# EAGLE design flotsamRowControllerv11a (EAGLE 6.5.0)
CNAME: Pattern Matrix Row Controller; CREVISION: 1.1; DESIGNER: Andy Smith
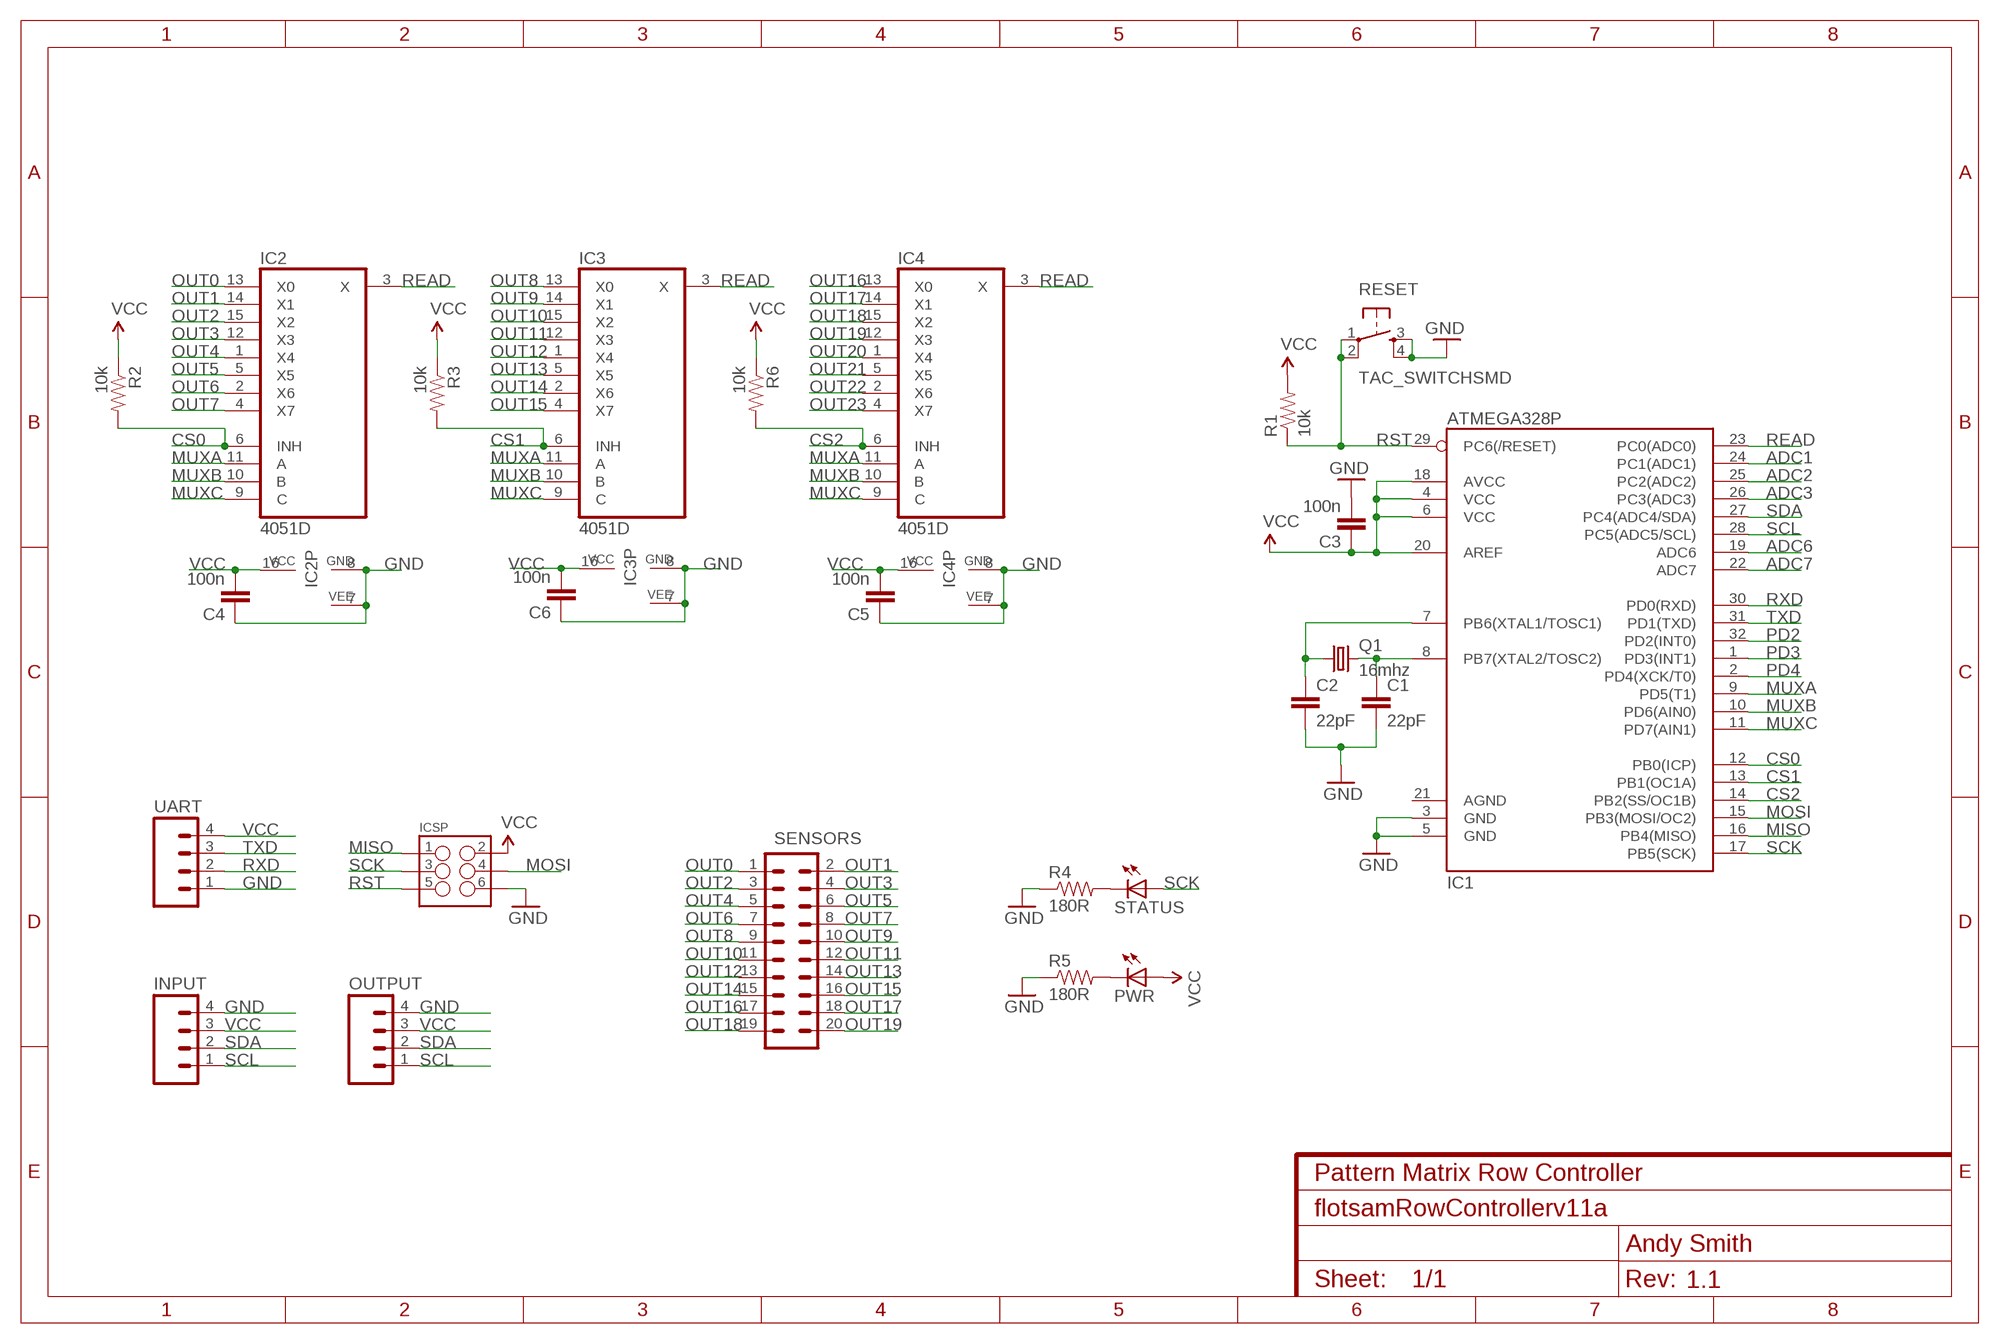
[diagram p0: schematic, sheet 1]

## Parts
C1  22pF  CAP0805  [0805]
C2  22pF  CAP0805  [0805]
C3  100n  CAP0805  [0805]
C4  100n  CAP0805  [0805]
C5  100n  CAP0805  [0805]
C6  100n  CAP0805  [0805]
IC1  ATMEGA328P  ATMEGA328_SMT  [TQFP32-08]
IC2  4051D  [SO16]
IC3  4051D  [SO16]
IC4  4051D  [SO16]
ICSP  M03X2FEMALE  [2X3]
INPUT  M04LOCK  [1X04_LOCK]
OUTPUT  M04LOCK  [1X04_LOCK]
PWR  LEDSML0805  [SML0805]
Q1  16mhz  CRYSTALHC49UP  [HC49UP]
R1  10k  RESISTOR0805-RES  [0805]
R2  10k  RESISTOR0805-RES  [0805]
R3  10k  RESISTOR0805-RES  [0805]
R4  180R  RESISTOR0805-RES  [0805]
R5  180R  RESISTOR0805-RES  [0805]
R6  10k  RESISTOR0805-RES  [0805]
RESET  TAC_SWITCHSMD  [TACTILE-SWITCH-SMD]
SENSORS  M10X22X10_LOCK  [2X10_LOCK]
STATUS  LEDSML0805  [SML0805]
UART  M04LOCK  [1X04_LOCK]

## Nets
ADC1: IC1.24(PC1(ADC1))
ADC2: IC1.25(PC2(ADC2))
ADC3: IC1.26(PC3(ADC3))
ADC6: IC1.19(ADC6)
ADC7: IC1.22(ADC7)
CS0: IC1.12(PB0(ICP)) IC2.6(INH) R2.2
CS1: IC1.13(PB1(OC1A)) IC3.6(INH) R3.2
CS2: IC1.14(PB2(SS/OC1B)) IC4.6(INH) R6.2
GND: C1.2 C2.2 C3.2 C4.1 C5.1 C6.1 IC1.3(GND) IC1.5(GND) IC2.7(VEE) IC2.8(GND) IC3.7(VEE) IC3.8(GND) IC4.7(VEE) IC4.8(GND) ICSP.6 INPUT.4 OUTPUT.4 R4.1 R5.1 RESET.3 RESET.4 UART.1
MISO: IC1.16(PB4(MISO)) ICSP.1
MOSI: IC1.15(PB3(MOSI/OC2)) ICSP.4
MUXA: IC1.9(PD5(T1)) IC2.11(A) IC3.11(A) IC4.11(A)
MUXB: IC1.10(PD6(AIN0)) IC2.10(B) IC3.10(B) IC4.10(B)
MUXC: IC1.11(PD7(AIN1)) IC2.9(C) IC3.9(C) IC4.9(C)
N$1: C1.1 IC1.8(PB7(XTAL2/TOSC2)) Q1.2
N$2: C2.1 IC1.7(PB6(XTAL1/TOSC1)) Q1.1
N$3: PWR.C R5.2
N$4: R4.2 STATUS.C
OUT0: IC2.13(X0) SENSORS.1
OUT1: IC2.14(X1) SENSORS.2
OUT2: IC2.15(X2) SENSORS.3
OUT3: IC2.12(X3) SENSORS.4
OUT4: IC2.1(X4) SENSORS.5
OUT5: IC2.5(X5) SENSORS.6
OUT6: IC2.2(X6) SENSORS.7
OUT7: IC2.4(X7) SENSORS.8
OUT8: IC3.13(X0) SENSORS.9
OUT9: IC3.14(X1) SENSORS.10
OUT10: IC3.15(X2) SENSORS.11
OUT11: IC3.12(X3) SENSORS.12
OUT12: IC3.1(X4) SENSORS.13
OUT13: IC3.5(X5) SENSORS.14
OUT14: IC3.2(X6) SENSORS.15
OUT15: IC3.4(X7) SENSORS.16
OUT16: IC4.13(X0) SENSORS.17
OUT17: IC4.14(X1) SENSORS.18
OUT18: IC4.15(X2) SENSORS.19
OUT19: IC4.12(X3) SENSORS.20
OUT20: IC4.1(X4)
OUT21: IC4.5(X5)
OUT22: IC4.2(X6)
OUT23: IC4.4(X7)
PD2: IC1.32(PD2(INT0))
PD3: IC1.1(PD3(INT1))
PD4: IC1.2(PD4(XCK/T0))
READ: IC1.23(PC0(ADC0)) IC2.3(X) IC3.3(X) IC4.3(X)
RST: IC1.29(PC6(/RESET)) ICSP.5 R1.1 RESET.1 RESET.2
RXD: IC1.30(PD0(RXD)) UART.2
SCK: IC1.17(PB5(SCK)) ICSP.3 STATUS.A
SCL: IC1.28(PC5(ADC5/SCL)) INPUT.1 OUTPUT.1
SDA: IC1.27(PC4(ADC4/SDA)) INPUT.2 OUTPUT.2
TXD: IC1.31(PD1(TXD)) UART.3
VCC: C3.1 C4.2 C5.2 C6.2 IC1.4(VCC) IC1.6(VCC) IC1.18(AVCC) IC1.20(AREF) IC2.16(VCC) IC3.16(VCC) IC4.16(VCC) ICSP.2 INPUT.3 OUTPUT.3 PWR.A R1.2 R2.1 R3.1 R6.1 UART.4
Unconnected: IC1.21(AGND)

## Library data of the parts
C1-C6 = SparkFun-Capacitors:CAP: Capacitor Standard 0603 ceramic capacitor, and 0.1" leaded capacitor.
IC1 = SparkFun-DigitalIC:ATMEGA328_SMT: 32-Pin Atmega328 part Commonly used on Arduino compatible boards Available in QFP and QFN packages TQFP is IC-09069 QFN is non-stock; PROD_ID: IC-09069
IC2-IC4 = 40xx:4051: 8-channel ANALOG MULTIPLEXER
ICSP = SparkFun-Connectors:M03X2: 2x3 .1" header. Shrouded, with keying- CONN-10681 SMT- CONN-11415 Pogo pins- HW-11044; PROD_ID: CONN-11566; VALUE: FEMALE 2x3
INPUT OUTPUT UART = SparkFun-Connectors:M04: Header 4 Standard 4-pin 0.1" header. Use with straight break away headers (SKU : PRT-00116), right angle break away headers (PRT-00553), swiss pins (PRT-00743), machine pins (PRT-00117), and female headers (PRT-00115). Molex polarized connector foot print use with SKU : PRT-08231 with associated crimp pins and housings. 1MM SMD Version SKU: PRT-10208
PWR STATUS = led:LED: LED OSRAM: - CHIPLED LG R971, LG N971, LY N971, LG Q971, LY Q971, LO R971, LY R971 LH N974, LH R974 LS Q976, LO Q976, LY Q976 LO Q996 - Hyper CHIPLED LW Q18S LB Q993, LB Q99A, LB R99A - SideLED LS A670, LO A670, LY A670, LG A670, LP A670 LB A673, LV A673, LT A673, LW A673 LH A674 LY A675 LS A676, LA A676, LO A676, LY A676, LW A676 LS A679, LY A679, LG A679 - Hyper Micro SIDELED® LS Y876, LA Y876, LO Y876, LY Y876 LT Y87S - SmartLED LW L88C, LW L88S LB L89C, LB L89S, LG L890 LS L89K, LO L89K, LY L89K LS L896, LA L896, LO L896, LY L896 - TOPLED LS T670, LO T670, LY T670, LG T670, LP T670 LSG T670, LSP T670, LSY T670, LOP T670, LYG T670 LG T671, LOG T671, LSG T671 LB T673, LV T673, LT T673, LW T673 LH T674 LS T676, LA T676, LO T676, LY T676, LB T676, LH T676, LSB T676, LW T676 LB T67C, LV T67C, LT T67C, LS T67K, LO T67K, LY T67K, LW E67C LS E67B, LA E67B, LO E67B, LY E67B, LB E67C, LV E67C, LT E67C LW T67C LS T679, LY T679, LG T679 LS T770, LO T770, LY T770, LG T770, LP T770 LB T773, LV T773, LT T773, LW T773 LH T774 LS E675, LA E675, LY E675, LS T675 LS T776, LA T776, LO T776, LY T776, LB T776 LHGB T686 LT T68C, LB T68C - Hyper Mini TOPLED® LB M676 - Mini TOPLED Santana® LG M470 LS M47K, LO M47K, LY M47K Source: http://www.osram.convergy.de LUXEON: - LUMILED® LXK2-PW12-R00, LXK2-PW12-S00, LXK2-PW14-U00, LXK2-PW14-V00 LXK2-PM12-R00, LXK2-PM12-S00, LXK2-PM14-U00 LXK2-PE12-Q00, LXK2-PE12-R00, LXK2-PE12-S00, LXK2-PE14-T00, LXK2-PE14-U00 LXK2-PB12-K00, LXK2-PB12-L00, LXK2-PB12-M00, LXK2-PB14-N00, LXK2-PB14-P00, LXK2-PB14-Q00 LXK2-PR12-L00, LXK2-PR12-M00, LXK2-PR14-Q00, LXK2-PR14-R00 LXK2-PD12-Q00, LXK2-PD12-R00, LXK2-PD12-S00 LXK2-PH12-R00, LXK2-PH12-S00 LXK2-PL12-P00, LXK2-PL12-Q00, LXK2-PL12-R00 Source: www.luxeon.com KINGBRIGHT: KA-3528ASYC Source: www.kingbright.com
Q1 = crystal:CRYSTAL: CRYSTAL; OC_FARNELL: unknown; OC_NEWARK: unknown
R1-R6 = SparkFun-Resistors:RESISTOR: Resistor Basic schematic elements and footprints for 0603, 1206, and PTH resistors.
RESET = SparkFun-Electromechanical:TAC_SWITCH: Momentary Switch Button commonly used for reset or general input. Spark Fun Electronics SKU : COM-00097 SMT- SWCH-08247; PROD_ID: SWCH-08247
SENSORS = SparkFun-Connectors:M10X2: This was SPECIALLY designed to be used with our Graphic LCD Backpack. Be sure you want to use this! It is not only staggered on each line of header holes, but IT IS ALSO offset of the center point of the top and bottom lines by 5 mil. This causes the headers to lock into place on the "standard" footprint on the LCD screen. The extra squares on the tdocu layer are there simply to reference other pins (if you were to actually populate a longer header than ten long - this is what we do with the backpacks).

## Board
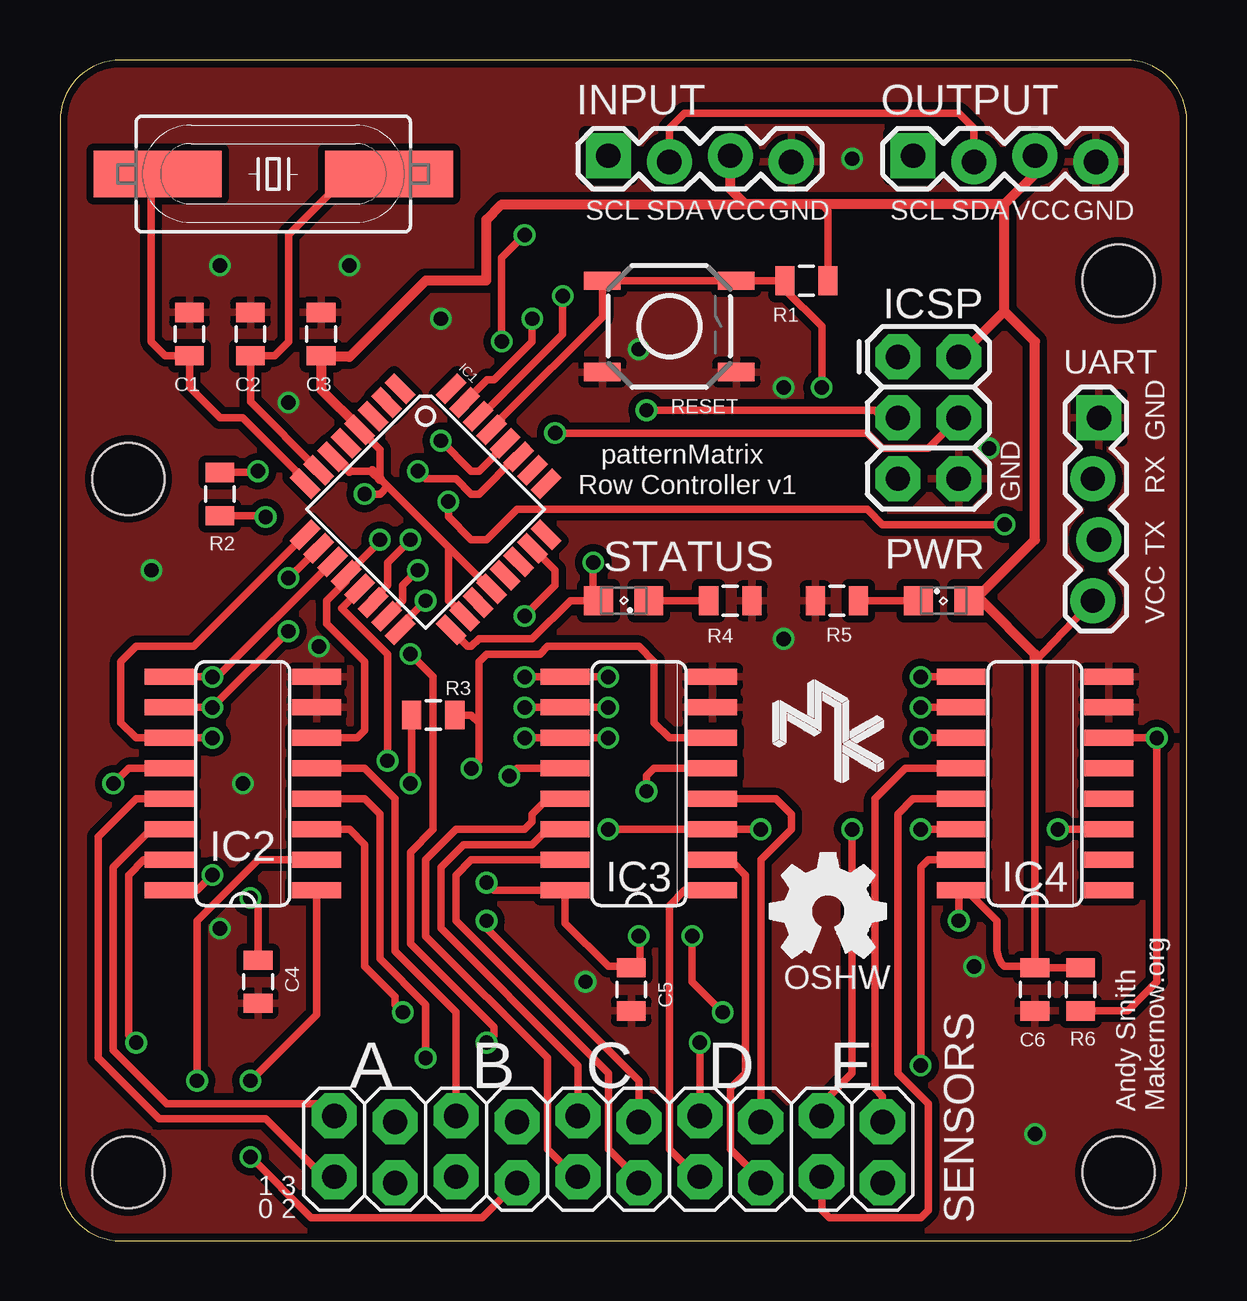
[diagram p1: board, top side]
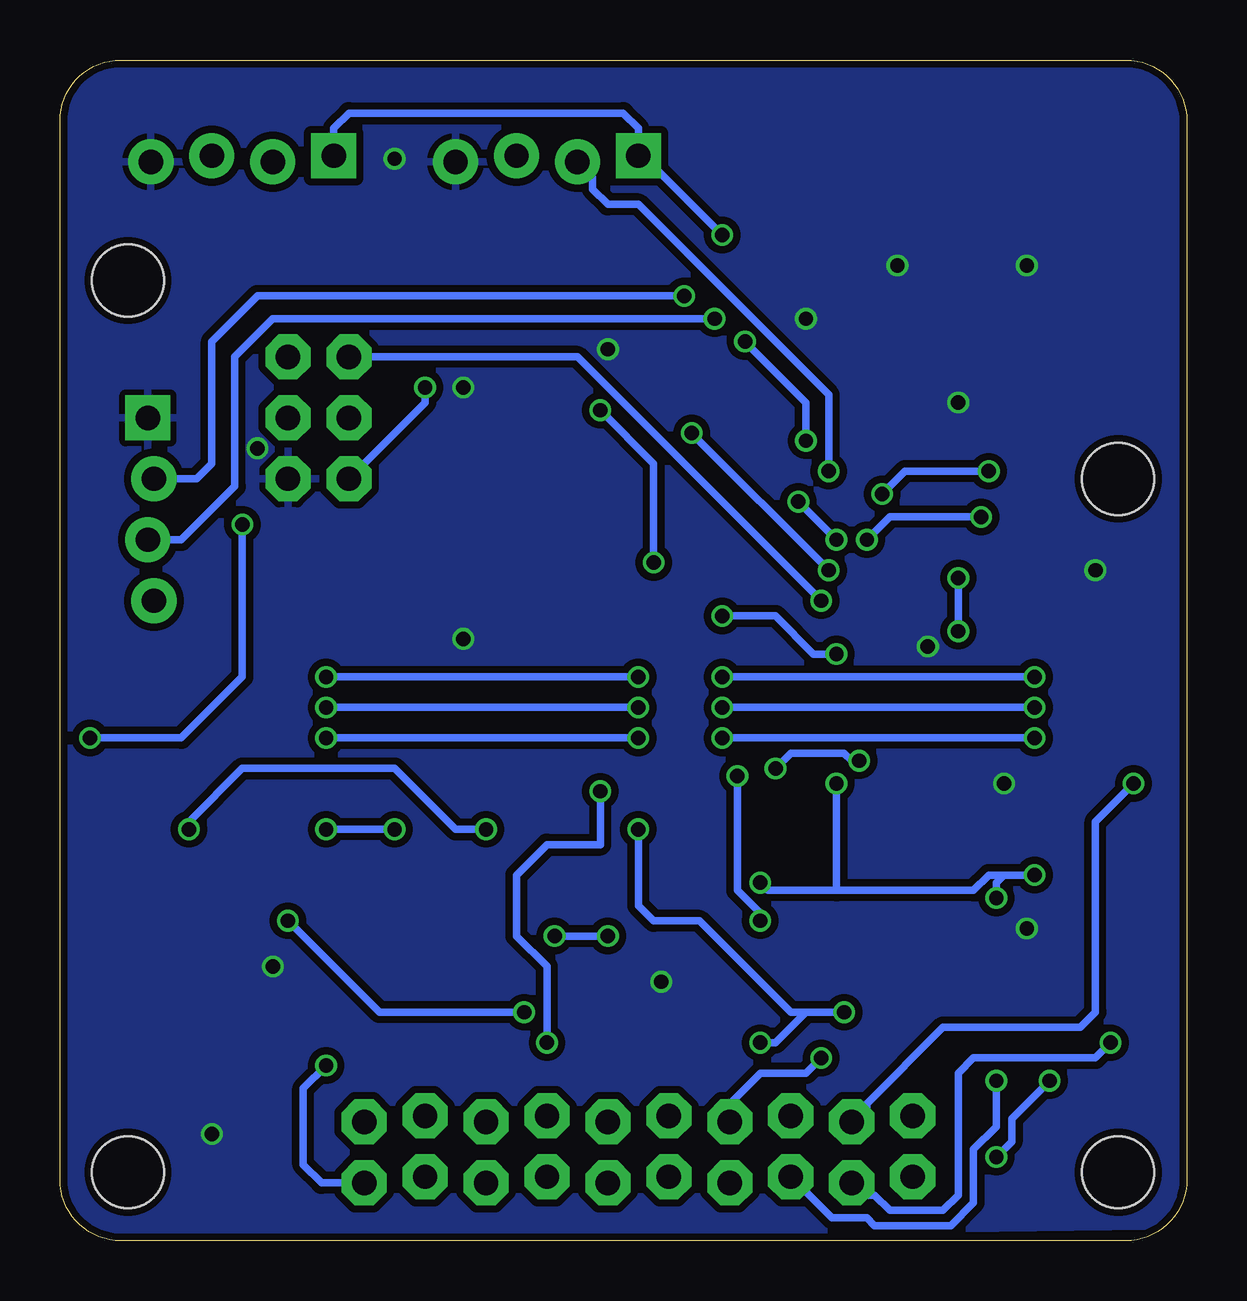
[diagram p2: board, bottom side, seen from below]

Size 46.97 x 49.2 mm. Coordinates in mm from the lower left corner, seen from the top.
Outline: 0,46.66 0,2.54 arc90 2.54,0 44.43,0 arc90 46.97,2.54 46.97,46.66 arc90 44.43,49.2 2.54,49.2 arc90 0,46.66
Copper layers (1*16): Top 0.035mm / dielectric 1.5mm / Bottom 0.035mm
Design rules "dirt_cheap_dirty_boards.v1": minimum track width 5mil, minimum drill 12mil, track to track 5mil, track to pad 5mil, pad to pad 5mil, via to via 5mil, smd to smd 0mil, copper to edge 10mil, drill to drill 10mil, minimum pad ring 10mil, minimum via ring 6mil, stop-mask expansion 2mil, vias tented up to drill 25mil, thermal gap 10mil
Holes 3 mm at 44.13,40.01 2.86,2.86 2.86,31.75 44.13,2.86

### Footprints (pad centres in the part's own frame; a part is rotated, then mirrored left to right if it is on the bottom)
0805 = smd 0.8 x 1.2: 1 -0.9,0; 2 0.9,0
TQFP32-08 = smd 1.27 x 0.559: 1 -4.293,2.8; 2 -4.293,2; 3 -4.293,1.2; 4 -4.293,0.4; 5 -4.293,-0.4; 6 -4.293,-1.2; 7 -4.293,-2; 8 -4.293,-2.8; 17 4.293,-2.8; 18 4.293,-2; 19 4.293,-1.2; 20 4.293,-0.4; 21 4.293,0.4; 22 4.293,1.2; 23 4.293,2; 24 4.293,2.8 | smd 0.559 x 1.27: 9 -2.8,-4.293; 10 -2,-4.293; 11 -1.2,-4.293; 12 -0.4,-4.293; 13 0.4,-4.293; 14 1.2,-4.293; 15 2,-4.293; 16 2.8,-4.293; 25 2.8,4.293; 26 2,4.293; 27 1.2,4.293; 28 0.4,4.293; 29 -0.4,4.293; 30 -1.2,4.293; 31 -2,4.293; 32 -2.8,4.293
SO16 = smd 0.66 x 2.032: 1 -4.445,-3.073; 2 -3.175,-3.073; 3 -1.905,-3.073; 4 -0.635,-3.073; 5 0.635,-3.073; 6 1.905,-3.073; 7 3.175,-3.073; 8 4.445,-3.073; 9 4.445,3.073; 10 3.175,3.073; 11 1.905,3.073; 12 0.635,3.073; 13 -0.635,3.073; 14 -1.905,3.073; 15 -3.175,3.073; 16 -4.445,3.073
2X3 = drill 1.016 pad 1.88 octagon: 1 0,0; 2 0,2.54; 3 2.54,0; 4 2.54,2.54; 5 5.08,0; 6 5.08,2.54
1X04_LOCK = drill 1.016 pad 1.88 square: 1 0,0.127 | drill 1.016 pad 1.88: 2 2.54,-0.127; 3 5.08,0.127; 4 7.62,-0.127
SML0805 = smd 1.2 x 1.2: A 1.05,0; C -1.05,0
HC49UP = smd 5.334 x 1.93: 1 -4.826,0; 2 4.826,0
TACTILE-SWITCH-SMD = smd 1.524 x 0.762: 1 -2.794,1.905; 2 2.794,1.905; 3 -2.794,-1.905; 4 2.794,-1.905
2X10_LOCK = drill 1.016 pad 1.88 octagon: 1 -11.43,-1.143; 2 -11.43,1.397; 3 -8.89,-1.397; 4 -8.89,1.143; 5 -6.35,-1.143; 6 -6.35,1.397; 7 -3.81,-1.397; 8 -3.81,1.143; 9 -1.27,-1.143; 10 -1.27,1.397; 11 1.27,-1.397; 12 1.27,1.143; 13 3.81,-1.143; 14 3.81,1.397; 15 6.35,-1.397; 16 6.35,1.143; 17 8.89,-1.143; 18 8.89,1.397; 19 11.43,-1.397; 20 11.43,1.143

### Placement (x,y rotation side)
C1  5.4,37.78 90 top
C2  7.94,37.78 90 top
C3  10.89,37.78 90 top
C4  8.26,10.79 90 top
C5  23.81,10.48 90 top
C6  40.64,10.48 90 top
IC1  15.24,30.48 315 top
IC2  7.62,19.05 90 top
IC3  24.13,19.05 90 top
IC4  40.64,19.05 90 top
ICSP  34.92,36.83 270 top
INPUT  22.86,45.09 0 top
OUTPUT  35.56,45.09 0 top
PWR  36.83,26.67 0 top
Q1  8.89,44.45 180 top
R1  31.11,40.01 0 top
R2  6.67,31.11 270 top
R3  15.56,21.91 0 top
R4  27.94,26.67 180 top
R5  32.38,26.67 0 top
R6  42.55,10.48 270 top
RESET  25.4,38.1 0 top
SENSORS  22.86,3.81 0 top
STATUS  23.5,26.67 180 top
U$1  [MK_5MM]  29.53,18.73 0 top
U$2  [OSHW_5MM]  29.53,11.75 0 top
UART  43.18,34.29 270 top

### Tracks (layer width: path | path; a pad name or v marks a point on that pad's centre or on a via)
CS0  (via drill 0.6)
  Top 0.305: R2.2 8.57,30.21 v8.57,30.16 | v13.34,29.21 13.34,29.14 IC1.12 11.92,27.48 11.11,26.67 11.11,25.72 12.7,24.13 12.7,21.27 12.38,20.95 IC2.6
  Bottom 0.305: v8.57,30.16 12.38,30.16 v13.34,29.21
CS1  (via drill 0.6)
  Top 0.305: IC1.13 12.49,27.09 11.75,26.35 13.65,24.45 v13.65,20 | IC3.6 25.4,20.95 24.77,21.59 24.77,24.13 24.13,24.77 20.32,24.77 20,24.45 17.78,24.45 17.46,24.13 17.46,21.59 | 17.46,21.59 17.46,20 v17.14,19.68 | R3.2 17.14,21.91 17.46,21.59
  Bottom 0.305: v13.65,20 13.97,20 14.29,20.32 16.51,20.32 v17.14,19.68
CS2  (via drill 0.6)
  Top 0.305: IC1.14 13.05,26.71 13.65,27.3 13.65,28.26 v14.61,29.21 | v16.19,30.8 16.19,30.16 17.14,29.21 17.78,29.21 19.05,30.48 33.66,30.48 34.29,29.84 v39.37,29.84 | R6.2 44.5,9.58 45.72,10.79 v45.72,20.95 IC4.6
  Bottom 0.305: v14.61,29.21 v16.19,30.8 | v39.37,29.84 39.37,23.5 41.91,20.95 v45.72,20.95
GND  (via drill 0.6)
  other vias: 6.67,13.02 21.91,10.79 9.53,34.92 33.02,45.09 10.79,24.77 38.1,11.43 38.73,33.02 30.16,25.08 30.16,35.56 24.13,37.15 15.88,38.42 6.67,40.64 12.06,40.64 3.81,27.94 7.62,19.05 40.64,4.45
  pour Bottom (isolate 0.305): 0,0.64 0,50.16 46.99,50.16 46.99,0
  pour Top (isolate 0.305): 0,0 0,50.16 46.99,50.16 46.99,0
MISO  (via drill 0.6)
  Top 0.305: IC1.16 14.19,25.61 v15.24,26.67
  Bottom 0.305: v15.24,26.67 25.4,36.83 ICSP.1
MOSI  (via drill 0.6)
  Top 0.305: IC1.15 13.65,26.03 14.29,26.67 14.29,27.3 v14.92,27.94 | v20.64,33.66 33.66,33.66 34.29,33.02 36.2,33.02 ICSP.4
  Bottom 0.305: v14.92,27.94 v20.64,33.66
MUXA  (via drill 0.6)
  Top 0.305: IC2.11 v6.35,20.95 3.17,20.95 2.54,21.59 2.54,24.13 3.17,24.77 5.57,24.77 IC1.9 | v19.37,20.95 IC3.11 v22.86,20.95 | IC4.11 v35.88,20.95
  Bottom 0.305: v6.35,20.95 v19.37,20.95 | v35.88,20.95 v22.86,20.95
MUXB  (via drill 0.6)
  Top 0.305: IC2.10 v6.35,22.23 v9.53,25.4 | v19.37,22.23 IC3.10 v22.86,22.23 | IC4.10 v35.88,22.23 | v9.53,27.62 9.55,27.62 IC1.10
  Bottom 0.305: v6.35,22.23 v19.37,22.23 | v35.88,22.23 v22.86,22.23 | v9.53,25.4 v9.53,27.62
MUXC  (via drill 0.6)
  Top 0.305: IC2.9 v6.35,23.5 6.56,23.5 IC1.11 | v19.37,23.5 IC3.9 v22.86,23.5 | IC4.9 v35.88,23.5
  Bottom 0.305: v6.35,23.5 v19.37,23.5 | v35.88,23.5 v22.86,23.5
N$1
  Top 0.305: IC1.8 9.84,31.92 9.84,32.07 7.62,34.29 6.67,34.29 5.4,35.56 C1.1 4.39,36.88 3.81,37.47 3.81,44.2 Q1.2
N$2
  Top 0.305: IC1.7 7.94,34.95 C2.1 8.94,36.88 9.53,37.47 9.53,41.91 11.43,43.81 12.06,44.45 Q1.1
N$3
  Top 0.305: R5.2 PWR.C
N$4
  Top 0.305: STATUS.C R4.2
OUT0
  Top 0.305: SENSORS.1 10.99,2.67 8.57,5.08 4.13,5.08 1.59,7.62 1.59,16.83 3.17,18.41 IC2.13
OUT1
  Top 0.305: SENSORS.2 10.92,5.71 4.45,5.71 2.22,7.94 2.22,15.56 3.81,17.14 IC2.14
OUT2  (via drill 0.6)
  Top 0.305: IC2.15 3.49,15.88 2.86,15.24 2.86,8.57 v3.17,8.26
  Bottom 0.305: SENSORS.3 13.46,1.91 13.02,1.91 12.38,1.27 10.16,1.27 9.53,1.91 9.53,6.99 8.89,7.62 3.81,7.62 v3.17,8.26
OUT3  (via drill 0.6)
  Top 0.305: IC2.12 2.86,19.68 v2.22,19.05
  Bottom 0.305: SENSORS.4 13.34,5.59 13.34,5.71 10.16,8.89 4.45,8.89 3.81,9.53 3.81,17.46 v2.22,19.05
OUT4  (via drill 0.6)
  Top 0.305: IC2.1 10.69,9.42 v7.94,6.67
  Bottom 0.305: v7.94,6.67 7.94,4.76 8.89,3.81 8.89,1.59 9.84,0.64 13.02,0.64 13.34,0.95 14.8,0.95 SENSORS.5
OUT5
  Top 0.305: SENSORS.6 16.51,9.53 13.97,12.06 13.97,18.41 12.7,19.68 IC2.5
OUT6  (via drill 0.6)
  Top 0.305: v5.71,6.67 5.71,13.34 8.26,15.88 IC2.2 | v7.94,3.49 10.48,0.95 17.59,0.95 SENSORS.7
  Bottom 0.305: v5.71,6.67 7.3,5.08 7.3,4.13 v7.94,3.49
OUT7  (via drill 0.6)
  Top 0.305: v15.24,7.62 15.24,9.84 13.34,11.75 13.34,17.78 12.7,18.41 IC2.4
  Bottom 0.305: SENSORS.8 19.05,5.71 17.78,6.99 15.88,6.99 v15.24,7.62
OUT8
  Top 0.305: SENSORS.9 21.46,2.67 20.32,3.81 20.32,7.62 15.24,12.7 15.24,15.88 16.51,17.14 19.37,17.14 19.68,17.46 19.68,17.78 20.32,18.41 IC3.13
OUT9
  Top 0.305: SENSORS.10 21.59,7.3 15.88,13.02 15.88,15.56 16.83,16.51 19.68,16.51 20.32,17.14 IC3.14
OUT10
  Top 0.305: SENSORS.11 24.13,2.54 22.86,3.81 22.86,6.99 16.51,13.34 16.51,15.24 17.14,15.88 IC3.15
OUT11  (via drill 0.6)
  Top 0.305: v18.73,19.37 19.05,19.68 IC3.12 | SENSORS.12 24.13,6.67 17.78,13.02 v17.78,13.34
  Bottom 0.305: v18.73,19.37 18.73,14.61 17.78,13.65 v17.78,13.34
OUT12
  Top 0.305: SENSORS.13 26.54,2.67 25.4,3.81 25.4,13.97 26.04,14.61 IC3.1
OUT13  (via drill 0.6)
  Top 0.305: SENSORS.14 v26.67,8.26 | IC3.5 24.77,19.68 24.45,19.37 v24.45,18.73
  Bottom 0.305: v24.45,18.73 24.45,16.51 26.67,16.51 27.94,15.24 27.94,12.7 26.67,11.43 v26.67,8.26
OUT14
  Top 0.305: SENSORS.15 29.21,2.54 27.94,3.81 27.94,6.35 28.57,6.99 28.57,15.24 27.94,15.88 IC3.2
OUT15
  Top 0.305: SENSORS.16 29.21,15.88 30.48,17.14 30.48,17.78 29.84,18.41 IC3.4
OUT16
  Top 0.305: SENSORS.17 31.75,1.27 32.07,0.95 35.88,0.95 36.2,1.27 36.2,5.71 34.92,6.99 34.92,17.78 35.56,18.41 IC4.13
OUT17  (via drill 0.6)
  Top 0.305: SENSORS.18 31.75,5.71 33.02,6.99 v33.02,17.14 | v35.88,17.14 IC4.14
  Bottom 0.305: v33.02,17.14 v35.88,17.14
OUT18  (via drill 0.6)
  Top 0.305: v35.88,7.3 35.88,15.56 36.2,15.88 IC4.15
  Bottom 0.305: SENSORS.19 36.07,2.41 36.83,3.17 36.83,6.35 v35.88,7.3
OUT19
  Top 0.305: IC4.12 35.24,19.68 33.97,18.41 33.97,6.35 34.29,6.03 SENSORS.20
READ  (via drill 0.6)
  Top 0.305: IC2.3 12.06,17.14 12.7,16.51 12.7,11.43 13.97,10.16 13.97,9.84 v14.29,9.53 | v22.86,17.14 IC3.3 v29.21,17.14 | IC4.3 v41.59,17.14 | IC1.23 19.72,28.86 20.64,27.94 20.64,27.3 v19.37,26.04 | v17.78,8.26 18.1,8.57 18.1,8.89 14.61,12.38 14.61,16.19 15.56,17.14 15.56,19.37 15.56,20 15.56,23.5 v14.61,24.45
  Bottom 0.305: v14.29,9.53 15.88,9.53 | 15.88,9.53 16.51,9.53 20.32,13.34 22.23,13.34 22.86,13.97 v22.86,17.14 | v41.59,17.14 41.59,17.46 39.37,19.68 33.02,19.68 30.48,17.14 v29.21,17.14 | v19.37,26.04 17.14,26.04 15.56,24.45 v14.61,24.45 | v17.78,8.26 17.14,8.26 15.88,9.53
RST  (via drill 0.6)
  Top 0.305: IC1.29 18.41,34.22 18.41,34.29 22.61,38.48 RESET.1 RESET.2 R1.1 30.21,39.63 31.75,38.1 v31.75,35.56
  Bottom 0.305: v31.75,35.56 31.75,34.92 ICSP.5
RXD  (via drill 0.6)
  Top 0.305: IC1.30 17.54,34.36 20.95,37.78 v20.95,39.37
  Bottom 0.305: UART.2 41.27,31.75 40.64,32.38 40.64,37.47 38.73,39.37 21.59,39.37 v20.95,39.37
SCK  (via drill 0.6)
  Top 0.305: ICSP.3 34.29,34.29 33.97,34.61 v24.45,34.61 | v22.23,28.26 22.23,26.89 STATUS.A 21.27,26.67 19.68,25.08 17.46,25.08 17.14,24.77 17,24.77 IC1.17
  Bottom 0.305: v24.45,34.61 22.23,32.38 v22.23,28.26
SCL  (via drill 0.6)
  Top 0.305: IC1.28 18.56,33.16 17.46,32.07 17.14,32.07 v15.88,33.34 | v18.41,37.47 18.41,40.96 v19.37,41.91
  Bottom 0.305: OUTPUT.1 35.56,46.35 34.92,46.99 23.5,46.99 22.86,46.35 INPUT.1 22.42,44.77 22.23,44.77 v19.37,41.91 | v15.88,33.34 15.88,34.92 v18.41,37.47
SDA  (via drill 0.6)
  Top 0.305: OUTPUT.2 38.1,46.35 37.47,46.99 26.04,46.99 25.4,46.35 INPUT.2 | IC1.27 19.01,32.67 17.46,31.11 17.14,31.11 16.51,31.75 15.24,31.75 v14.92,32.07
  Bottom 0.305: v14.92,32.07 14.92,35.24 22.86,43.18 24.13,43.18 24.77,43.81 24.77,44.32 INPUT.2
TXD  (via drill 0.6)
  Top 0.305: v19.68,38.42 19.68,37.47 18.1,35.88 17.81,35.88 IC1.31
  Bottom 0.305: UART.3 41.91,29.21 39.69,31.43 39.69,36.83 38.1,38.42 v19.68,38.42
VCC  (via drill 0.6)
  Top 0.305: IC2.16 5.71,14.61 v6.35,15.24 | v37.47,13.34 37.47,14.5 IC4.16 arc-45 37.94,14.45 39.05,13.34 39.05,12.2 arc45 39.37,11.43 40.51,11.43 arc-45 C6.2 | C4.2 8.26,13.97 v7.94,14.29 | v26.35,12.7 26.35,10.79 v27.62,9.53 | 17.92,27.16 16.19,28.89 | 16.19,28.89 13.65,31.43 | 13.65,31.43 13.34,31.75 13.34,32.95 IC1.4 | 12.06,32.07 13.02,32.07 | 16.19,28.89 16.19,26.67 16.22,26.67 IC1.18 | C6.2 40.64,24.13 UART.4 | R1.2 32.02,42.91 31.75,43.18 | v17.78,14.92 18.1,14.61 IC3.16 21.06,13.23 22.86,11.43 23.76,11.43 C5.2 24.18,11.38 24.18,12.65 v24.13,12.7 | R2.1 8.2,32.02 v8.26,32.07 | v12.7,31.11 13.34,31.11 13.65,31.43 | R3.1 14.66,19.1 v14.61,19.05 | C6.2 R6.1
  Top 0.406: IC1.20 17.92,27.16 | IC1.6 11.47,32.67 12.06,32.07 | 13.02,32.07 13.34,31.75 | IC1.4 12.49,33.87 10.89,35.47 C3.1 10.93,36.83 12.06,36.83 15.24,40.01 17.78,40.01 17.78,42.55 18.41,43.18 28.57,43.18 | OUTPUT.3 40.64,44.45 39.37,43.18 | 39.37,43.18 31.75,43.18 28.57,43.18 | 28.57,43.18 27.94,43.81 INPUT.3 | ICSP.2 39.37,38.73 | 39.37,38.73 39.37,43.18 | 40.64,24.13 40.64,24.45 38.42,26.67 PWR.A 38.1,26.67 40.64,29.21 40.64,37.47 39.37,38.73
  Bottom 0.305: v6.35,15.24 7.62,15.24 | 7.62,15.24 8.26,15.24 8.89,14.61 14.61,14.61 | 14.61,14.61 17.46,14.61 v17.78,14.92 | v24.13,12.7 v26.35,12.7 | v7.94,14.29 7.94,14.92 7.62,15.24 | v27.62,9.53 33.66,9.53 v37.47,13.34 | v8.26,32.07 11.75,32.07 v12.7,31.11 | v14.61,19.05 14.61,14.61

### Text on the board
tPlace: SCL | SDA | VCC | GND | SCL | SDA | VCC | GND | GND | patternMatrix | Row Controller v1 | GND | RX | TX | VCC | OSHW | A | B | C | D | E | Andy Smith / Makernow.org | 1 3 | 0 2